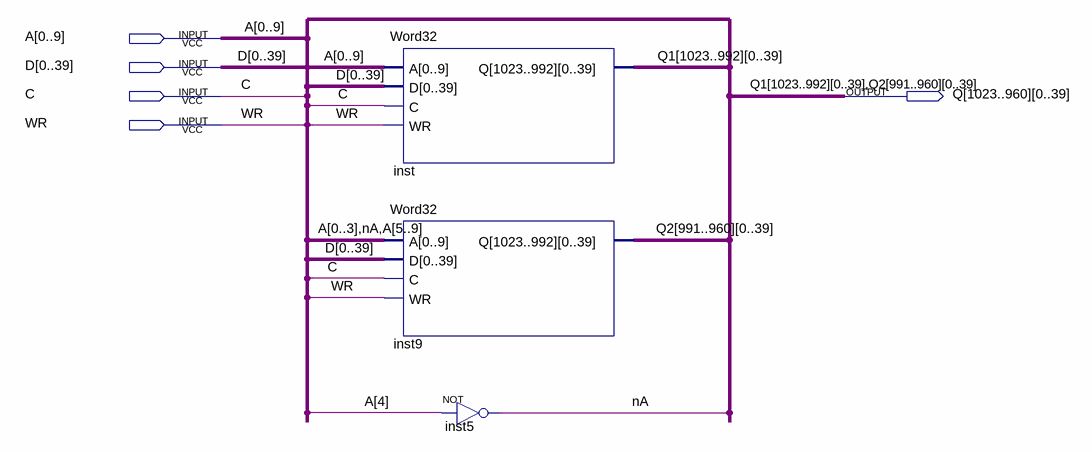
[diagram p0: schematic sheet]
// Quartus schematic Word64.bdf as structural Verilog: 3 symbols, 5 pins
module Word64 (
  input  [0:9] A,
  input  [0:39] D,
  input  C,
  input  WR,
  output [39:0] Q_1023,
  output [39:0] Q_1022,
  output [39:0] Q_1021,
  output [39:0] Q_1020,
  output [39:0] Q_1019,
  output [39:0] Q_1018,
  output [39:0] Q_1017,
  output [39:0] Q_1016,
  output [39:0] Q_1015,
  output [39:0] Q_1014,
  output [39:0] Q_1013,
  output [39:0] Q_1012,
  output [39:0] Q_1011,
  output [39:0] Q_1010,
  output [39:0] Q_1009,
  output [39:0] Q_1008,
  output [39:0] Q_1007,
  output [39:0] Q_1006,
  output [39:0] Q_1005,
  output [39:0] Q_1004,
  output [39:0] Q_1003,
  output [39:0] Q_1002,
  output [39:0] Q_1001,
  output [39:0] Q_1000,
  output [39:0] Q_999,
  output [39:0] Q_998,
  output [39:0] Q_997,
  output [39:0] Q_996,
  output [39:0] Q_995,
  output [39:0] Q_994,
  output [39:0] Q_993,
  output [39:0] Q_992,
  output [39:0] Q_991,
  output [39:0] Q_990,
  output [39:0] Q_989,
  output [39:0] Q_988,
  output [39:0] Q_987,
  output [39:0] Q_986,
  output [39:0] Q_985,
  output [39:0] Q_984,
  output [39:0] Q_983,
  output [39:0] Q_982,
  output [39:0] Q_981,
  output [39:0] Q_980,
  output [39:0] Q_979,
  output [39:0] Q_978,
  output [39:0] Q_977,
  output [39:0] Q_976,
  output [39:0] Q_975,
  output [39:0] Q_974,
  output [39:0] Q_973,
  output [39:0] Q_972,
  output [39:0] Q_971,
  output [39:0] Q_970,
  output [39:0] Q_969,
  output [39:0] Q_968,
  output [39:0] Q_967,
  output [39:0] Q_966,
  output [39:0] Q_965,
  output [39:0] Q_964,
  output [39:0] Q_963,
  output [39:0] Q_962,
  output [39:0] Q_961,
  output [39:0] Q_960
);

  wire nA;

  Word32 inst (
    .A(A), .D(D), .C(C), .WR(WR),
    .Q({Q_1023[0], Q_1023[1], Q_1023[2], Q_1023[3], Q_1023[4], Q_1023[5], Q_1023[6], Q_1023[7], Q_1023[8], Q_1023[9], Q_1023[10], Q_1023[11], Q_1023[12], Q_1023[13], Q_1023[14], Q_1023[15], Q_1023[16], Q_1023[17], Q_1023[18], Q_1023[19], Q_1023[20], Q_1023[21], Q_1023[22], Q_1023[23], Q_1023[24], Q_1023[25], Q_1023[26], Q_1023[27], Q_1023[28], Q_1023[29], Q_1023[30], Q_1023[31], Q_1023[32], Q_1023[33], Q_1023[34], Q_1023[35], Q_1023[36], Q_1023[37], Q_1023[38], Q_1023[39], Q_1022[0], Q_1022[1], Q_1022[2], Q_1022[3], Q_1022[4], Q_1022[5], Q_1022[6], Q_1022[7], Q_1022[8], Q_1022[9], Q_1022[10], Q_1022[11], Q_1022[12], Q_1022[13], Q_1022[14], Q_1022[15], Q_1022[16], Q_1022[17], Q_1022[18], Q_1022[19], Q_1022[20], Q_1022[21], Q_1022[22], Q_1022[23], Q_1022[24], Q_1022[25], Q_1022[26], Q_1022[27], Q_1022[28], Q_1022[29], Q_1022[30], Q_1022[31], Q_1022[32], Q_1022[33], Q_1022[34], Q_1022[35], Q_1022[36], Q_1022[37], Q_1022[38], Q_1022[39], Q_1021[0], Q_1021[1], Q_1021[2], Q_1021[3], Q_1021[4], Q_1021[5], Q_1021[6], Q_1021[7], Q_1021[8], Q_1021[9], Q_1021[10], Q_1021[11], Q_1021[12], Q_1021[13], Q_1021[14], Q_1021[15], Q_1021[16], Q_1021[17], Q_1021[18], Q_1021[19], Q_1021[20], Q_1021[21], Q_1021[22], Q_1021[23], Q_1021[24], Q_1021[25], Q_1021[26], Q_1021[27], Q_1021[28], Q_1021[29], Q_1021[30], Q_1021[31], Q_1021[32], Q_1021[33], Q_1021[34], Q_1021[35], Q_1021[36], Q_1021[37], Q_1021[38], Q_1021[39], Q_1020[0], Q_1020[1], Q_1020[2], Q_1020[3], Q_1020[4], Q_1020[5], Q_1020[6], Q_1020[7], Q_1020[8], Q_1020[9], Q_1020[10], Q_1020[11], Q_1020[12], Q_1020[13], Q_1020[14], Q_1020[15], Q_1020[16], Q_1020[17], Q_1020[18], Q_1020[19], Q_1020[20], Q_1020[21], Q_1020[22], Q_1020[23], Q_1020[24], Q_1020[25], Q_1020[26], Q_1020[27], Q_1020[28], Q_1020[29], Q_1020[30], Q_1020[31], Q_1020[32], Q_1020[33], Q_1020[34], Q_1020[35], Q_1020[36], Q_1020[37], Q_1020[38], Q_1020[39], Q_1019[0], Q_1019[1], Q_1019[2], Q_1019[3], Q_1019[4], Q_1019[5], Q_1019[6], Q_1019[7], Q_1019[8], Q_1019[9], Q_1019[10], Q_1019[11], Q_1019[12], Q_1019[13], Q_1019[14], Q_1019[15], Q_1019[16], Q_1019[17], Q_1019[18], Q_1019[19], Q_1019[20], Q_1019[21], Q_1019[22], Q_1019[23], Q_1019[24], Q_1019[25], Q_1019[26], Q_1019[27], Q_1019[28], Q_1019[29], Q_1019[30], Q_1019[31], Q_1019[32], Q_1019[33], Q_1019[34], Q_1019[35], Q_1019[36], Q_1019[37], Q_1019[38], Q_1019[39], Q_1018[0], Q_1018[1], Q_1018[2], Q_1018[3], Q_1018[4], Q_1018[5], Q_1018[6], Q_1018[7], Q_1018[8], Q_1018[9], Q_1018[10], Q_1018[11], Q_1018[12], Q_1018[13], Q_1018[14], Q_1018[15], Q_1018[16], Q_1018[17], Q_1018[18], Q_1018[19], Q_1018[20], Q_1018[21], Q_1018[22], Q_1018[23], Q_1018[24], Q_1018[25], Q_1018[26], Q_1018[27], Q_1018[28], Q_1018[29], Q_1018[30], Q_1018[31], Q_1018[32], Q_1018[33], Q_1018[34], Q_1018[35], Q_1018[36], Q_1018[37], Q_1018[38], Q_1018[39], Q_1017[0], Q_1017[1], Q_1017[2], Q_1017[3], Q_1017[4], Q_1017[5], Q_1017[6], Q_1017[7], Q_1017[8], Q_1017[9], Q_1017[10], Q_1017[11], Q_1017[12], Q_1017[13], Q_1017[14], Q_1017[15], Q_1017[16], Q_1017[17], Q_1017[18], Q_1017[19], Q_1017[20], Q_1017[21], Q_1017[22], Q_1017[23], Q_1017[24], Q_1017[25], Q_1017[26], Q_1017[27], Q_1017[28], Q_1017[29], Q_1017[30], Q_1017[31], Q_1017[32], Q_1017[33], Q_1017[34], Q_1017[35], Q_1017[36], Q_1017[37], Q_1017[38], Q_1017[39], Q_1016[0], Q_1016[1], Q_1016[2], Q_1016[3], Q_1016[4], Q_1016[5], Q_1016[6], Q_1016[7], Q_1016[8], Q_1016[9], Q_1016[10], Q_1016[11], Q_1016[12], Q_1016[13], Q_1016[14], Q_1016[15], Q_1016[16], Q_1016[17], Q_1016[18], Q_1016[19], Q_1016[20], Q_1016[21], Q_1016[22], Q_1016[23], Q_1016[24], Q_1016[25], Q_1016[26], Q_1016[27], Q_1016[28], Q_1016[29], Q_1016[30], Q_1016[31], Q_1016[32], Q_1016[33], Q_1016[34], Q_1016[35], Q_1016[36], Q_1016[37], Q_1016[38], Q_1016[39], Q_1015[0], Q_1015[1], Q_1015[2], Q_1015[3], Q_1015[4], Q_1015[5], Q_1015[6], Q_1015[7], Q_1015[8], Q_1015[9], Q_1015[10], Q_1015[11], Q_1015[12], Q_1015[13], Q_1015[14], Q_1015[15], Q_1015[16], Q_1015[17], Q_1015[18], Q_1015[19], Q_1015[20], Q_1015[21], Q_1015[22], Q_1015[23], Q_1015[24], Q_1015[25], Q_1015[26], Q_1015[27], Q_1015[28], Q_1015[29], Q_1015[30], Q_1015[31], Q_1015[32], Q_1015[33], Q_1015[34], Q_1015[35], Q_1015[36], Q_1015[37], Q_1015[38], Q_1015[39], Q_1014[0], Q_1014[1], Q_1014[2], Q_1014[3], Q_1014[4], Q_1014[5], Q_1014[6], Q_1014[7], Q_1014[8], Q_1014[9], Q_1014[10], Q_1014[11], Q_1014[12], Q_1014[13], Q_1014[14], Q_1014[15], Q_1014[16], Q_1014[17], Q_1014[18], Q_1014[19], Q_1014[20], Q_1014[21], Q_1014[22], Q_1014[23], Q_1014[24], Q_1014[25], Q_1014[26], Q_1014[27], Q_1014[28], Q_1014[29], Q_1014[30], Q_1014[31], Q_1014[32], Q_1014[33], Q_1014[34], Q_1014[35], Q_1014[36], Q_1014[37], Q_1014[38], Q_1014[39], Q_1013[0], Q_1013[1], Q_1013[2], Q_1013[3], Q_1013[4], Q_1013[5], Q_1013[6], Q_1013[7], Q_1013[8], Q_1013[9], Q_1013[10], Q_1013[11], Q_1013[12], Q_1013[13], Q_1013[14], Q_1013[15], Q_1013[16], Q_1013[17], Q_1013[18], Q_1013[19], Q_1013[20], Q_1013[21], Q_1013[22], Q_1013[23], Q_1013[24], Q_1013[25], Q_1013[26], Q_1013[27], Q_1013[28], Q_1013[29], Q_1013[30], Q_1013[31], Q_1013[32], Q_1013[33], Q_1013[34], Q_1013[35], Q_1013[36], Q_1013[37], Q_1013[38], Q_1013[39], Q_1012[0], Q_1012[1], Q_1012[2], Q_1012[3], Q_1012[4], Q_1012[5], Q_1012[6], Q_1012[7], Q_1012[8], Q_1012[9], Q_1012[10], Q_1012[11], Q_1012[12], Q_1012[13], Q_1012[14], Q_1012[15], Q_1012[16], Q_1012[17], Q_1012[18], Q_1012[19], Q_1012[20], Q_1012[21], Q_1012[22], Q_1012[23], Q_1012[24], Q_1012[25], Q_1012[26], Q_1012[27], Q_1012[28], Q_1012[29], Q_1012[30], Q_1012[31], Q_1012[32], Q_1012[33], Q_1012[34], Q_1012[35], Q_1012[36], Q_1012[37], Q_1012[38], Q_1012[39], Q_1011[0], Q_1011[1], Q_1011[2], Q_1011[3], Q_1011[4], Q_1011[5], Q_1011[6], Q_1011[7], Q_1011[8], Q_1011[9], Q_1011[10], Q_1011[11], Q_1011[12], Q_1011[13], Q_1011[14], Q_1011[15], Q_1011[16], Q_1011[17], Q_1011[18], Q_1011[19], Q_1011[20], Q_1011[21], Q_1011[22], Q_1011[23], Q_1011[24], Q_1011[25], Q_1011[26], Q_1011[27], Q_1011[28], Q_1011[29], Q_1011[30], Q_1011[31], Q_1011[32], Q_1011[33], Q_1011[34], Q_1011[35], Q_1011[36], Q_1011[37], Q_1011[38], Q_1011[39], Q_1010[0], Q_1010[1], Q_1010[2], Q_1010[3], Q_1010[4], Q_1010[5], Q_1010[6], Q_1010[7], Q_1010[8], Q_1010[9], Q_1010[10], Q_1010[11], Q_1010[12], Q_1010[13], Q_1010[14], Q_1010[15], Q_1010[16], Q_1010[17], Q_1010[18], Q_1010[19], Q_1010[20], Q_1010[21], Q_1010[22], Q_1010[23], Q_1010[24], Q_1010[25], Q_1010[26], Q_1010[27], Q_1010[28], Q_1010[29], Q_1010[30], Q_1010[31], Q_1010[32], Q_1010[33], Q_1010[34], Q_1010[35], Q_1010[36], Q_1010[37], Q_1010[38], Q_1010[39], Q_1009[0], Q_1009[1], Q_1009[2], Q_1009[3], Q_1009[4], Q_1009[5], Q_1009[6], Q_1009[7], Q_1009[8], Q_1009[9], Q_1009[10], Q_1009[11], Q_1009[12], Q_1009[13], Q_1009[14], Q_1009[15], Q_1009[16], Q_1009[17], Q_1009[18], Q_1009[19], Q_1009[20], Q_1009[21], Q_1009[22], Q_1009[23], Q_1009[24], Q_1009[25], Q_1009[26], Q_1009[27], Q_1009[28], Q_1009[29], Q_1009[30], Q_1009[31], Q_1009[32], Q_1009[33], Q_1009[34], Q_1009[35], Q_1009[36], Q_1009[37], Q_1009[38], Q_1009[39], Q_1008[0], Q_1008[1], Q_1008[2], Q_1008[3], Q_1008[4], Q_1008[5], Q_1008[6], Q_1008[7], Q_1008[8], Q_1008[9], Q_1008[10], Q_1008[11], Q_1008[12], Q_1008[13], Q_1008[14], Q_1008[15], Q_1008[16], Q_1008[17], Q_1008[18], Q_1008[19], Q_1008[20], Q_1008[21], Q_1008[22], Q_1008[23], Q_1008[24], Q_1008[25], Q_1008[26], Q_1008[27], Q_1008[28], Q_1008[29], Q_1008[30], Q_1008[31], Q_1008[32], Q_1008[33], Q_1008[34], Q_1008[35], Q_1008[36], Q_1008[37], Q_1008[38], Q_1008[39], Q_1007[0], Q_1007[1], Q_1007[2], Q_1007[3], Q_1007[4], Q_1007[5], Q_1007[6], Q_1007[7], Q_1007[8], Q_1007[9], Q_1007[10], Q_1007[11], Q_1007[12], Q_1007[13], Q_1007[14], Q_1007[15], Q_1007[16], Q_1007[17], Q_1007[18], Q_1007[19], Q_1007[20], Q_1007[21], Q_1007[22], Q_1007[23], Q_1007[24], Q_1007[25], Q_1007[26], Q_1007[27], Q_1007[28], Q_1007[29], Q_1007[30], Q_1007[31], Q_1007[32], Q_1007[33], Q_1007[34], Q_1007[35], Q_1007[36], Q_1007[37], Q_1007[38], Q_1007[39], Q_1006[0], Q_1006[1], Q_1006[2], Q_1006[3], Q_1006[4], Q_1006[5], Q_1006[6], Q_1006[7], Q_1006[8], Q_1006[9], Q_1006[10], Q_1006[11], Q_1006[12], Q_1006[13], Q_1006[14], Q_1006[15], Q_1006[16], Q_1006[17], Q_1006[18], Q_1006[19], Q_1006[20], Q_1006[21], Q_1006[22], Q_1006[23], Q_1006[24], Q_1006[25], Q_1006[26], Q_1006[27], Q_1006[28], Q_1006[29], Q_1006[30], Q_1006[31], Q_1006[32], Q_1006[33], Q_1006[34], Q_1006[35], Q_1006[36], Q_1006[37], Q_1006[38], Q_1006[39], Q_1005[0], Q_1005[1], Q_1005[2], Q_1005[3], Q_1005[4], Q_1005[5], Q_1005[6], Q_1005[7], Q_1005[8], Q_1005[9], Q_1005[10], Q_1005[11], Q_1005[12], Q_1005[13], Q_1005[14], Q_1005[15], Q_1005[16], Q_1005[17], Q_1005[18], Q_1005[19], Q_1005[20], Q_1005[21], Q_1005[22], Q_1005[23], Q_1005[24], Q_1005[25], Q_1005[26], Q_1005[27], Q_1005[28], Q_1005[29], Q_1005[30], Q_1005[31], Q_1005[32], Q_1005[33], Q_1005[34], Q_1005[35], Q_1005[36], Q_1005[37], Q_1005[38], Q_1005[39], Q_1004[0], Q_1004[1], Q_1004[2], Q_1004[3], Q_1004[4], Q_1004[5], Q_1004[6], Q_1004[7], Q_1004[8], Q_1004[9], Q_1004[10], Q_1004[11], Q_1004[12], Q_1004[13], Q_1004[14], Q_1004[15], Q_1004[16], Q_1004[17], Q_1004[18], Q_1004[19], Q_1004[20], Q_1004[21], Q_1004[22], Q_1004[23], Q_1004[24], Q_1004[25], Q_1004[26], Q_1004[27], Q_1004[28], Q_1004[29], Q_1004[30], Q_1004[31], Q_1004[32], Q_1004[33], Q_1004[34], Q_1004[35], Q_1004[36], Q_1004[37], Q_1004[38], Q_1004[39], Q_1003[0], Q_1003[1], Q_1003[2], Q_1003[3], Q_1003[4], Q_1003[5], Q_1003[6], Q_1003[7], Q_1003[8], Q_1003[9], Q_1003[10], Q_1003[11], Q_1003[12], Q_1003[13], Q_1003[14], Q_1003[15], Q_1003[16], Q_1003[17], Q_1003[18], Q_1003[19], Q_1003[20], Q_1003[21], Q_1003[22], Q_1003[23], Q_1003[24], Q_1003[25], Q_1003[26], Q_1003[27], Q_1003[28], Q_1003[29], Q_1003[30], Q_1003[31], Q_1003[32], Q_1003[33], Q_1003[34], Q_1003[35], Q_1003[36], Q_1003[37], Q_1003[38], Q_1003[39], Q_1002[0], Q_1002[1], Q_1002[2], Q_1002[3], Q_1002[4], Q_1002[5], Q_1002[6], Q_1002[7], Q_1002[8], Q_1002[9], Q_1002[10], Q_1002[11], Q_1002[12], Q_1002[13], Q_1002[14], Q_1002[15], Q_1002[16], Q_1002[17], Q_1002[18], Q_1002[19], Q_1002[20], Q_1002[21], Q_1002[22], Q_1002[23], Q_1002[24], Q_1002[25], Q_1002[26], Q_1002[27], Q_1002[28], Q_1002[29], Q_1002[30], Q_1002[31], Q_1002[32], Q_1002[33], Q_1002[34], Q_1002[35], Q_1002[36], Q_1002[37], Q_1002[38], Q_1002[39], Q_1001[0], Q_1001[1], Q_1001[2], Q_1001[3], Q_1001[4], Q_1001[5], Q_1001[6], Q_1001[7], Q_1001[8], Q_1001[9], Q_1001[10], Q_1001[11], Q_1001[12], Q_1001[13], Q_1001[14], Q_1001[15], Q_1001[16], Q_1001[17], Q_1001[18], Q_1001[19], Q_1001[20], Q_1001[21], Q_1001[22], Q_1001[23], Q_1001[24], Q_1001[25], Q_1001[26], Q_1001[27], Q_1001[28], Q_1001[29], Q_1001[30], Q_1001[31], Q_1001[32], Q_1001[33], Q_1001[34], Q_1001[35], Q_1001[36], Q_1001[37], Q_1001[38], Q_1001[39], Q_1000[0], Q_1000[1], Q_1000[2], Q_1000[3], Q_1000[4], Q_1000[5], Q_1000[6], Q_1000[7], Q_1000[8], Q_1000[9], Q_1000[10], Q_1000[11], Q_1000[12], Q_1000[13], Q_1000[14], Q_1000[15], Q_1000[16], Q_1000[17], Q_1000[18], Q_1000[19], Q_1000[20], Q_1000[21], Q_1000[22], Q_1000[23], Q_1000[24], Q_1000[25], Q_1000[26], Q_1000[27], Q_1000[28], Q_1000[29], Q_1000[30], Q_1000[31], Q_1000[32], Q_1000[33], Q_1000[34], Q_1000[35], Q_1000[36], Q_1000[37], Q_1000[38], Q_1000[39], Q_999[0], Q_999[1], Q_999[2], Q_999[3], Q_999[4], Q_999[5], Q_999[6], Q_999[7], Q_999[8], Q_999[9], Q_999[10], Q_999[11], Q_999[12], Q_999[13], Q_999[14], Q_999[15], Q_999[16], Q_999[17], Q_999[18], Q_999[19], Q_999[20], Q_999[21], Q_999[22], Q_999[23], Q_999[24], Q_999[25], Q_999[26], Q_999[27], Q_999[28], Q_999[29], Q_999[30], Q_999[31], Q_999[32], Q_999[33], Q_999[34], Q_999[35], Q_999[36], Q_999[37], Q_999[38], Q_999[39], Q_998[0], Q_998[1], Q_998[2], Q_998[3], Q_998[4], Q_998[5], Q_998[6], Q_998[7], Q_998[8], Q_998[9], Q_998[10], Q_998[11], Q_998[12], Q_998[13], Q_998[14], Q_998[15], Q_998[16], Q_998[17], Q_998[18], Q_998[19], Q_998[20], Q_998[21], Q_998[22], Q_998[23], Q_998[24], Q_998[25], Q_998[26], Q_998[27], Q_998[28], Q_998[29], Q_998[30], Q_998[31], Q_998[32], Q_998[33], Q_998[34], Q_998[35], Q_998[36], Q_998[37], Q_998[38], Q_998[39], Q_997[0], Q_997[1], Q_997[2], Q_997[3], Q_997[4], Q_997[5], Q_997[6], Q_997[7], Q_997[8], Q_997[9], Q_997[10], Q_997[11], Q_997[12], Q_997[13], Q_997[14], Q_997[15], Q_997[16], Q_997[17], Q_997[18], Q_997[19], Q_997[20], Q_997[21], Q_997[22], Q_997[23], Q_997[24], Q_997[25], Q_997[26], Q_997[27], Q_997[28], Q_997[29], Q_997[30], Q_997[31], Q_997[32], Q_997[33], Q_997[34], Q_997[35], Q_997[36], Q_997[37], Q_997[38], Q_997[39], Q_996[0], Q_996[1], Q_996[2], Q_996[3], Q_996[4], Q_996[5], Q_996[6], Q_996[7], Q_996[8], Q_996[9], Q_996[10], Q_996[11], Q_996[12], Q_996[13], Q_996[14], Q_996[15], Q_996[16], Q_996[17], Q_996[18], Q_996[19], Q_996[20], Q_996[21], Q_996[22], Q_996[23], Q_996[24], Q_996[25], Q_996[26], Q_996[27], Q_996[28], Q_996[29], Q_996[30], Q_996[31], Q_996[32], Q_996[33], Q_996[34], Q_996[35], Q_996[36], Q_996[37], Q_996[38], Q_996[39], Q_995[0], Q_995[1], Q_995[2], Q_995[3], Q_995[4], Q_995[5], Q_995[6], Q_995[7], Q_995[8], Q_995[9], Q_995[10], Q_995[11], Q_995[12], Q_995[13], Q_995[14], Q_995[15], Q_995[16], Q_995[17], Q_995[18], Q_995[19], Q_995[20], Q_995[21], Q_995[22], Q_995[23], Q_995[24], Q_995[25], Q_995[26], Q_995[27], Q_995[28], Q_995[29], Q_995[30], Q_995[31], Q_995[32], Q_995[33], Q_995[34], Q_995[35], Q_995[36], Q_995[37], Q_995[38], Q_995[39], Q_994[0], Q_994[1], Q_994[2], Q_994[3], Q_994[4], Q_994[5], Q_994[6], Q_994[7], Q_994[8], Q_994[9], Q_994[10], Q_994[11], Q_994[12], Q_994[13], Q_994[14], Q_994[15], Q_994[16], Q_994[17], Q_994[18], Q_994[19], Q_994[20], Q_994[21], Q_994[22], Q_994[23], Q_994[24], Q_994[25], Q_994[26], Q_994[27], Q_994[28], Q_994[29], Q_994[30], Q_994[31], Q_994[32], Q_994[33], Q_994[34], Q_994[35], Q_994[36], Q_994[37], Q_994[38], Q_994[39], Q_993[0], Q_993[1], Q_993[2], Q_993[3], Q_993[4], Q_993[5], Q_993[6], Q_993[7], Q_993[8], Q_993[9], Q_993[10], Q_993[11], Q_993[12], Q_993[13], Q_993[14], Q_993[15], Q_993[16], Q_993[17], Q_993[18], Q_993[19], Q_993[20], Q_993[21], Q_993[22], Q_993[23], Q_993[24], Q_993[25], Q_993[26], Q_993[27], Q_993[28], Q_993[29], Q_993[30], Q_993[31], Q_993[32], Q_993[33], Q_993[34], Q_993[35], Q_993[36], Q_993[37], Q_993[38], Q_993[39], Q_992[0], Q_992[1], Q_992[2], Q_992[3], Q_992[4], Q_992[5], Q_992[6], Q_992[7], Q_992[8], Q_992[9], Q_992[10], Q_992[11], Q_992[12], Q_992[13], Q_992[14], Q_992[15], Q_992[16], Q_992[17], Q_992[18], Q_992[19], Q_992[20], Q_992[21], Q_992[22], Q_992[23], Q_992[24], Q_992[25], Q_992[26], Q_992[27], Q_992[28], Q_992[29], Q_992[30], Q_992[31], Q_992[32], Q_992[33], Q_992[34], Q_992[35], Q_992[36], Q_992[37], Q_992[38], Q_992[39]}));
  Word32 inst9 (
    .A({A[0:3], nA, A[5:9]}), .D(D), .C(C), .WR(WR),
    .Q({Q_991[0], Q_991[1], Q_991[2], Q_991[3], Q_991[4], Q_991[5], Q_991[6], Q_991[7], Q_991[8], Q_991[9], Q_991[10], Q_991[11], Q_991[12], Q_991[13], Q_991[14], Q_991[15], Q_991[16], Q_991[17], Q_991[18], Q_991[19], Q_991[20], Q_991[21], Q_991[22], Q_991[23], Q_991[24], Q_991[25], Q_991[26], Q_991[27], Q_991[28], Q_991[29], Q_991[30], Q_991[31], Q_991[32], Q_991[33], Q_991[34], Q_991[35], Q_991[36], Q_991[37], Q_991[38], Q_991[39], Q_990[0], Q_990[1], Q_990[2], Q_990[3], Q_990[4], Q_990[5], Q_990[6], Q_990[7], Q_990[8], Q_990[9], Q_990[10], Q_990[11], Q_990[12], Q_990[13], Q_990[14], Q_990[15], Q_990[16], Q_990[17], Q_990[18], Q_990[19], Q_990[20], Q_990[21], Q_990[22], Q_990[23], Q_990[24], Q_990[25], Q_990[26], Q_990[27], Q_990[28], Q_990[29], Q_990[30], Q_990[31], Q_990[32], Q_990[33], Q_990[34], Q_990[35], Q_990[36], Q_990[37], Q_990[38], Q_990[39], Q_989[0], Q_989[1], Q_989[2], Q_989[3], Q_989[4], Q_989[5], Q_989[6], Q_989[7], Q_989[8], Q_989[9], Q_989[10], Q_989[11], Q_989[12], Q_989[13], Q_989[14], Q_989[15], Q_989[16], Q_989[17], Q_989[18], Q_989[19], Q_989[20], Q_989[21], Q_989[22], Q_989[23], Q_989[24], Q_989[25], Q_989[26], Q_989[27], Q_989[28], Q_989[29], Q_989[30], Q_989[31], Q_989[32], Q_989[33], Q_989[34], Q_989[35], Q_989[36], Q_989[37], Q_989[38], Q_989[39], Q_988[0], Q_988[1], Q_988[2], Q_988[3], Q_988[4], Q_988[5], Q_988[6], Q_988[7], Q_988[8], Q_988[9], Q_988[10], Q_988[11], Q_988[12], Q_988[13], Q_988[14], Q_988[15], Q_988[16], Q_988[17], Q_988[18], Q_988[19], Q_988[20], Q_988[21], Q_988[22], Q_988[23], Q_988[24], Q_988[25], Q_988[26], Q_988[27], Q_988[28], Q_988[29], Q_988[30], Q_988[31], Q_988[32], Q_988[33], Q_988[34], Q_988[35], Q_988[36], Q_988[37], Q_988[38], Q_988[39], Q_987[0], Q_987[1], Q_987[2], Q_987[3], Q_987[4], Q_987[5], Q_987[6], Q_987[7], Q_987[8], Q_987[9], Q_987[10], Q_987[11], Q_987[12], Q_987[13], Q_987[14], Q_987[15], Q_987[16], Q_987[17], Q_987[18], Q_987[19], Q_987[20], Q_987[21], Q_987[22], Q_987[23], Q_987[24], Q_987[25], Q_987[26], Q_987[27], Q_987[28], Q_987[29], Q_987[30], Q_987[31], Q_987[32], Q_987[33], Q_987[34], Q_987[35], Q_987[36], Q_987[37], Q_987[38], Q_987[39], Q_986[0], Q_986[1], Q_986[2], Q_986[3], Q_986[4], Q_986[5], Q_986[6], Q_986[7], Q_986[8], Q_986[9], Q_986[10], Q_986[11], Q_986[12], Q_986[13], Q_986[14], Q_986[15], Q_986[16], Q_986[17], Q_986[18], Q_986[19], Q_986[20], Q_986[21], Q_986[22], Q_986[23], Q_986[24], Q_986[25], Q_986[26], Q_986[27], Q_986[28], Q_986[29], Q_986[30], Q_986[31], Q_986[32], Q_986[33], Q_986[34], Q_986[35], Q_986[36], Q_986[37], Q_986[38], Q_986[39], Q_985[0], Q_985[1], Q_985[2], Q_985[3], Q_985[4], Q_985[5], Q_985[6], Q_985[7], Q_985[8], Q_985[9], Q_985[10], Q_985[11], Q_985[12], Q_985[13], Q_985[14], Q_985[15], Q_985[16], Q_985[17], Q_985[18], Q_985[19], Q_985[20], Q_985[21], Q_985[22], Q_985[23], Q_985[24], Q_985[25], Q_985[26], Q_985[27], Q_985[28], Q_985[29], Q_985[30], Q_985[31], Q_985[32], Q_985[33], Q_985[34], Q_985[35], Q_985[36], Q_985[37], Q_985[38], Q_985[39], Q_984[0], Q_984[1], Q_984[2], Q_984[3], Q_984[4], Q_984[5], Q_984[6], Q_984[7], Q_984[8], Q_984[9], Q_984[10], Q_984[11], Q_984[12], Q_984[13], Q_984[14], Q_984[15], Q_984[16], Q_984[17], Q_984[18], Q_984[19], Q_984[20], Q_984[21], Q_984[22], Q_984[23], Q_984[24], Q_984[25], Q_984[26], Q_984[27], Q_984[28], Q_984[29], Q_984[30], Q_984[31], Q_984[32], Q_984[33], Q_984[34], Q_984[35], Q_984[36], Q_984[37], Q_984[38], Q_984[39], Q_983[0], Q_983[1], Q_983[2], Q_983[3], Q_983[4], Q_983[5], Q_983[6], Q_983[7], Q_983[8], Q_983[9], Q_983[10], Q_983[11], Q_983[12], Q_983[13], Q_983[14], Q_983[15], Q_983[16], Q_983[17], Q_983[18], Q_983[19], Q_983[20], Q_983[21], Q_983[22], Q_983[23], Q_983[24], Q_983[25], Q_983[26], Q_983[27], Q_983[28], Q_983[29], Q_983[30], Q_983[31], Q_983[32], Q_983[33], Q_983[34], Q_983[35], Q_983[36], Q_983[37], Q_983[38], Q_983[39], Q_982[0], Q_982[1], Q_982[2], Q_982[3], Q_982[4], Q_982[5], Q_982[6], Q_982[7], Q_982[8], Q_982[9], Q_982[10], Q_982[11], Q_982[12], Q_982[13], Q_982[14], Q_982[15], Q_982[16], Q_982[17], Q_982[18], Q_982[19], Q_982[20], Q_982[21], Q_982[22], Q_982[23], Q_982[24], Q_982[25], Q_982[26], Q_982[27], Q_982[28], Q_982[29], Q_982[30], Q_982[31], Q_982[32], Q_982[33], Q_982[34], Q_982[35], Q_982[36], Q_982[37], Q_982[38], Q_982[39], Q_981[0], Q_981[1], Q_981[2], Q_981[3], Q_981[4], Q_981[5], Q_981[6], Q_981[7], Q_981[8], Q_981[9], Q_981[10], Q_981[11], Q_981[12], Q_981[13], Q_981[14], Q_981[15], Q_981[16], Q_981[17], Q_981[18], Q_981[19], Q_981[20], Q_981[21], Q_981[22], Q_981[23], Q_981[24], Q_981[25], Q_981[26], Q_981[27], Q_981[28], Q_981[29], Q_981[30], Q_981[31], Q_981[32], Q_981[33], Q_981[34], Q_981[35], Q_981[36], Q_981[37], Q_981[38], Q_981[39], Q_980[0], Q_980[1], Q_980[2], Q_980[3], Q_980[4], Q_980[5], Q_980[6], Q_980[7], Q_980[8], Q_980[9], Q_980[10], Q_980[11], Q_980[12], Q_980[13], Q_980[14], Q_980[15], Q_980[16], Q_980[17], Q_980[18], Q_980[19], Q_980[20], Q_980[21], Q_980[22], Q_980[23], Q_980[24], Q_980[25], Q_980[26], Q_980[27], Q_980[28], Q_980[29], Q_980[30], Q_980[31], Q_980[32], Q_980[33], Q_980[34], Q_980[35], Q_980[36], Q_980[37], Q_980[38], Q_980[39], Q_979[0], Q_979[1], Q_979[2], Q_979[3], Q_979[4], Q_979[5], Q_979[6], Q_979[7], Q_979[8], Q_979[9], Q_979[10], Q_979[11], Q_979[12], Q_979[13], Q_979[14], Q_979[15], Q_979[16], Q_979[17], Q_979[18], Q_979[19], Q_979[20], Q_979[21], Q_979[22], Q_979[23], Q_979[24], Q_979[25], Q_979[26], Q_979[27], Q_979[28], Q_979[29], Q_979[30], Q_979[31], Q_979[32], Q_979[33], Q_979[34], Q_979[35], Q_979[36], Q_979[37], Q_979[38], Q_979[39], Q_978[0], Q_978[1], Q_978[2], Q_978[3], Q_978[4], Q_978[5], Q_978[6], Q_978[7], Q_978[8], Q_978[9], Q_978[10], Q_978[11], Q_978[12], Q_978[13], Q_978[14], Q_978[15], Q_978[16], Q_978[17], Q_978[18], Q_978[19], Q_978[20], Q_978[21], Q_978[22], Q_978[23], Q_978[24], Q_978[25], Q_978[26], Q_978[27], Q_978[28], Q_978[29], Q_978[30], Q_978[31], Q_978[32], Q_978[33], Q_978[34], Q_978[35], Q_978[36], Q_978[37], Q_978[38], Q_978[39], Q_977[0], Q_977[1], Q_977[2], Q_977[3], Q_977[4], Q_977[5], Q_977[6], Q_977[7], Q_977[8], Q_977[9], Q_977[10], Q_977[11], Q_977[12], Q_977[13], Q_977[14], Q_977[15], Q_977[16], Q_977[17], Q_977[18], Q_977[19], Q_977[20], Q_977[21], Q_977[22], Q_977[23], Q_977[24], Q_977[25], Q_977[26], Q_977[27], Q_977[28], Q_977[29], Q_977[30], Q_977[31], Q_977[32], Q_977[33], Q_977[34], Q_977[35], Q_977[36], Q_977[37], Q_977[38], Q_977[39], Q_976[0], Q_976[1], Q_976[2], Q_976[3], Q_976[4], Q_976[5], Q_976[6], Q_976[7], Q_976[8], Q_976[9], Q_976[10], Q_976[11], Q_976[12], Q_976[13], Q_976[14], Q_976[15], Q_976[16], Q_976[17], Q_976[18], Q_976[19], Q_976[20], Q_976[21], Q_976[22], Q_976[23], Q_976[24], Q_976[25], Q_976[26], Q_976[27], Q_976[28], Q_976[29], Q_976[30], Q_976[31], Q_976[32], Q_976[33], Q_976[34], Q_976[35], Q_976[36], Q_976[37], Q_976[38], Q_976[39], Q_975[0], Q_975[1], Q_975[2], Q_975[3], Q_975[4], Q_975[5], Q_975[6], Q_975[7], Q_975[8], Q_975[9], Q_975[10], Q_975[11], Q_975[12], Q_975[13], Q_975[14], Q_975[15], Q_975[16], Q_975[17], Q_975[18], Q_975[19], Q_975[20], Q_975[21], Q_975[22], Q_975[23], Q_975[24], Q_975[25], Q_975[26], Q_975[27], Q_975[28], Q_975[29], Q_975[30], Q_975[31], Q_975[32], Q_975[33], Q_975[34], Q_975[35], Q_975[36], Q_975[37], Q_975[38], Q_975[39], Q_974[0], Q_974[1], Q_974[2], Q_974[3], Q_974[4], Q_974[5], Q_974[6], Q_974[7], Q_974[8], Q_974[9], Q_974[10], Q_974[11], Q_974[12], Q_974[13], Q_974[14], Q_974[15], Q_974[16], Q_974[17], Q_974[18], Q_974[19], Q_974[20], Q_974[21], Q_974[22], Q_974[23], Q_974[24], Q_974[25], Q_974[26], Q_974[27], Q_974[28], Q_974[29], Q_974[30], Q_974[31], Q_974[32], Q_974[33], Q_974[34], Q_974[35], Q_974[36], Q_974[37], Q_974[38], Q_974[39], Q_973[0], Q_973[1], Q_973[2], Q_973[3], Q_973[4], Q_973[5], Q_973[6], Q_973[7], Q_973[8], Q_973[9], Q_973[10], Q_973[11], Q_973[12], Q_973[13], Q_973[14], Q_973[15], Q_973[16], Q_973[17], Q_973[18], Q_973[19], Q_973[20], Q_973[21], Q_973[22], Q_973[23], Q_973[24], Q_973[25], Q_973[26], Q_973[27], Q_973[28], Q_973[29], Q_973[30], Q_973[31], Q_973[32], Q_973[33], Q_973[34], Q_973[35], Q_973[36], Q_973[37], Q_973[38], Q_973[39], Q_972[0], Q_972[1], Q_972[2], Q_972[3], Q_972[4], Q_972[5], Q_972[6], Q_972[7], Q_972[8], Q_972[9], Q_972[10], Q_972[11], Q_972[12], Q_972[13], Q_972[14], Q_972[15], Q_972[16], Q_972[17], Q_972[18], Q_972[19], Q_972[20], Q_972[21], Q_972[22], Q_972[23], Q_972[24], Q_972[25], Q_972[26], Q_972[27], Q_972[28], Q_972[29], Q_972[30], Q_972[31], Q_972[32], Q_972[33], Q_972[34], Q_972[35], Q_972[36], Q_972[37], Q_972[38], Q_972[39], Q_971[0], Q_971[1], Q_971[2], Q_971[3], Q_971[4], Q_971[5], Q_971[6], Q_971[7], Q_971[8], Q_971[9], Q_971[10], Q_971[11], Q_971[12], Q_971[13], Q_971[14], Q_971[15], Q_971[16], Q_971[17], Q_971[18], Q_971[19], Q_971[20], Q_971[21], Q_971[22], Q_971[23], Q_971[24], Q_971[25], Q_971[26], Q_971[27], Q_971[28], Q_971[29], Q_971[30], Q_971[31], Q_971[32], Q_971[33], Q_971[34], Q_971[35], Q_971[36], Q_971[37], Q_971[38], Q_971[39], Q_970[0], Q_970[1], Q_970[2], Q_970[3], Q_970[4], Q_970[5], Q_970[6], Q_970[7], Q_970[8], Q_970[9], Q_970[10], Q_970[11], Q_970[12], Q_970[13], Q_970[14], Q_970[15], Q_970[16], Q_970[17], Q_970[18], Q_970[19], Q_970[20], Q_970[21], Q_970[22], Q_970[23], Q_970[24], Q_970[25], Q_970[26], Q_970[27], Q_970[28], Q_970[29], Q_970[30], Q_970[31], Q_970[32], Q_970[33], Q_970[34], Q_970[35], Q_970[36], Q_970[37], Q_970[38], Q_970[39], Q_969[0], Q_969[1], Q_969[2], Q_969[3], Q_969[4], Q_969[5], Q_969[6], Q_969[7], Q_969[8], Q_969[9], Q_969[10], Q_969[11], Q_969[12], Q_969[13], Q_969[14], Q_969[15], Q_969[16], Q_969[17], Q_969[18], Q_969[19], Q_969[20], Q_969[21], Q_969[22], Q_969[23], Q_969[24], Q_969[25], Q_969[26], Q_969[27], Q_969[28], Q_969[29], Q_969[30], Q_969[31], Q_969[32], Q_969[33], Q_969[34], Q_969[35], Q_969[36], Q_969[37], Q_969[38], Q_969[39], Q_968[0], Q_968[1], Q_968[2], Q_968[3], Q_968[4], Q_968[5], Q_968[6], Q_968[7], Q_968[8], Q_968[9], Q_968[10], Q_968[11], Q_968[12], Q_968[13], Q_968[14], Q_968[15], Q_968[16], Q_968[17], Q_968[18], Q_968[19], Q_968[20], Q_968[21], Q_968[22], Q_968[23], Q_968[24], Q_968[25], Q_968[26], Q_968[27], Q_968[28], Q_968[29], Q_968[30], Q_968[31], Q_968[32], Q_968[33], Q_968[34], Q_968[35], Q_968[36], Q_968[37], Q_968[38], Q_968[39], Q_967[0], Q_967[1], Q_967[2], Q_967[3], Q_967[4], Q_967[5], Q_967[6], Q_967[7], Q_967[8], Q_967[9], Q_967[10], Q_967[11], Q_967[12], Q_967[13], Q_967[14], Q_967[15], Q_967[16], Q_967[17], Q_967[18], Q_967[19], Q_967[20], Q_967[21], Q_967[22], Q_967[23], Q_967[24], Q_967[25], Q_967[26], Q_967[27], Q_967[28], Q_967[29], Q_967[30], Q_967[31], Q_967[32], Q_967[33], Q_967[34], Q_967[35], Q_967[36], Q_967[37], Q_967[38], Q_967[39], Q_966[0], Q_966[1], Q_966[2], Q_966[3], Q_966[4], Q_966[5], Q_966[6], Q_966[7], Q_966[8], Q_966[9], Q_966[10], Q_966[11], Q_966[12], Q_966[13], Q_966[14], Q_966[15], Q_966[16], Q_966[17], Q_966[18], Q_966[19], Q_966[20], Q_966[21], Q_966[22], Q_966[23], Q_966[24], Q_966[25], Q_966[26], Q_966[27], Q_966[28], Q_966[29], Q_966[30], Q_966[31], Q_966[32], Q_966[33], Q_966[34], Q_966[35], Q_966[36], Q_966[37], Q_966[38], Q_966[39], Q_965[0], Q_965[1], Q_965[2], Q_965[3], Q_965[4], Q_965[5], Q_965[6], Q_965[7], Q_965[8], Q_965[9], Q_965[10], Q_965[11], Q_965[12], Q_965[13], Q_965[14], Q_965[15], Q_965[16], Q_965[17], Q_965[18], Q_965[19], Q_965[20], Q_965[21], Q_965[22], Q_965[23], Q_965[24], Q_965[25], Q_965[26], Q_965[27], Q_965[28], Q_965[29], Q_965[30], Q_965[31], Q_965[32], Q_965[33], Q_965[34], Q_965[35], Q_965[36], Q_965[37], Q_965[38], Q_965[39], Q_964[0], Q_964[1], Q_964[2], Q_964[3], Q_964[4], Q_964[5], Q_964[6], Q_964[7], Q_964[8], Q_964[9], Q_964[10], Q_964[11], Q_964[12], Q_964[13], Q_964[14], Q_964[15], Q_964[16], Q_964[17], Q_964[18], Q_964[19], Q_964[20], Q_964[21], Q_964[22], Q_964[23], Q_964[24], Q_964[25], Q_964[26], Q_964[27], Q_964[28], Q_964[29], Q_964[30], Q_964[31], Q_964[32], Q_964[33], Q_964[34], Q_964[35], Q_964[36], Q_964[37], Q_964[38], Q_964[39], Q_963[0], Q_963[1], Q_963[2], Q_963[3], Q_963[4], Q_963[5], Q_963[6], Q_963[7], Q_963[8], Q_963[9], Q_963[10], Q_963[11], Q_963[12], Q_963[13], Q_963[14], Q_963[15], Q_963[16], Q_963[17], Q_963[18], Q_963[19], Q_963[20], Q_963[21], Q_963[22], Q_963[23], Q_963[24], Q_963[25], Q_963[26], Q_963[27], Q_963[28], Q_963[29], Q_963[30], Q_963[31], Q_963[32], Q_963[33], Q_963[34], Q_963[35], Q_963[36], Q_963[37], Q_963[38], Q_963[39], Q_962[0], Q_962[1], Q_962[2], Q_962[3], Q_962[4], Q_962[5], Q_962[6], Q_962[7], Q_962[8], Q_962[9], Q_962[10], Q_962[11], Q_962[12], Q_962[13], Q_962[14], Q_962[15], Q_962[16], Q_962[17], Q_962[18], Q_962[19], Q_962[20], Q_962[21], Q_962[22], Q_962[23], Q_962[24], Q_962[25], Q_962[26], Q_962[27], Q_962[28], Q_962[29], Q_962[30], Q_962[31], Q_962[32], Q_962[33], Q_962[34], Q_962[35], Q_962[36], Q_962[37], Q_962[38], Q_962[39], Q_961[0], Q_961[1], Q_961[2], Q_961[3], Q_961[4], Q_961[5], Q_961[6], Q_961[7], Q_961[8], Q_961[9], Q_961[10], Q_961[11], Q_961[12], Q_961[13], Q_961[14], Q_961[15], Q_961[16], Q_961[17], Q_961[18], Q_961[19], Q_961[20], Q_961[21], Q_961[22], Q_961[23], Q_961[24], Q_961[25], Q_961[26], Q_961[27], Q_961[28], Q_961[29], Q_961[30], Q_961[31], Q_961[32], Q_961[33], Q_961[34], Q_961[35], Q_961[36], Q_961[37], Q_961[38], Q_961[39], Q_960[0], Q_960[1], Q_960[2], Q_960[3], Q_960[4], Q_960[5], Q_960[6], Q_960[7], Q_960[8], Q_960[9], Q_960[10], Q_960[11], Q_960[12], Q_960[13], Q_960[14], Q_960[15], Q_960[16], Q_960[17], Q_960[18], Q_960[19], Q_960[20], Q_960[21], Q_960[22], Q_960[23], Q_960[24], Q_960[25], Q_960[26], Q_960[27], Q_960[28], Q_960[29], Q_960[30], Q_960[31], Q_960[32], Q_960[33], Q_960[34], Q_960[35], Q_960[36], Q_960[37], Q_960[38], Q_960[39]}));
  not inst5 (nA, A[4]);

  // Other names for the same wires on the sheet: Q1_992[39:0] = Q_992; Q1_993[39:0] = Q_993; Q1_994[39:0] = Q_994;
  //   Q1_995[39:0] = Q_995; Q1_996[39:0] = Q_996; Q1_997[39:0] = Q_997; Q1_998[39:0] = Q_998; Q1_999[39:0] = Q_999;
  //   Q1_1000[39:0] = Q_1000; Q1_1001[39:0] = Q_1001; Q1_1002[39:0] = Q_1002; Q1_1003[39:0] = Q_1003;
  //   Q1_1004[39:0] = Q_1004; Q1_1005[39:0] = Q_1005; Q1_1006[39:0] = Q_1006; Q1_1007[39:0] = Q_1007;
  //   Q1_1008[39:0] = Q_1008; Q1_1009[39:0] = Q_1009; Q1_1010[39:0] = Q_1010; Q1_1011[39:0] = Q_1011;
  //   Q1_1012[39:0] = Q_1012; Q1_1013[39:0] = Q_1013; Q1_1014[39:0] = Q_1014; Q1_1015[39:0] = Q_1015;
  //   Q1_1016[39:0] = Q_1016; Q1_1017[39:0] = Q_1017; Q1_1018[39:0] = Q_1018; Q1_1019[39:0] = Q_1019;
  //   Q1_1020[39:0] = Q_1020; Q1_1021[39:0] = Q_1021; Q1_1022[39:0] = Q_1022; Q1_1023[39:0] = Q_1023;
  //   Q2_960[39:0] = Q_960; Q2_961[39:0] = Q_961; Q2_962[39:0] = Q_962; Q2_963[39:0] = Q_963; Q2_964[39:0] = Q_964;
  //   Q2_965[39:0] = Q_965; Q2_966[39:0] = Q_966; Q2_967[39:0] = Q_967; Q2_968[39:0] = Q_968; Q2_969[39:0] = Q_969;
  //   Q2_970[39:0] = Q_970; Q2_971[39:0] = Q_971; Q2_972[39:0] = Q_972; Q2_973[39:0] = Q_973; Q2_974[39:0] = Q_974;
  //   Q2_975[39:0] = Q_975; Q2_976[39:0] = Q_976; Q2_977[39:0] = Q_977; Q2_978[39:0] = Q_978; Q2_979[39:0] = Q_979;
  //   Q2_980[39:0] = Q_980; Q2_981[39:0] = Q_981; Q2_982[39:0] = Q_982; Q2_983[39:0] = Q_983; Q2_984[39:0] = Q_984;
  //   Q2_985[39:0] = Q_985; Q2_986[39:0] = Q_986; Q2_987[39:0] = Q_987; Q2_988[39:0] = Q_988; Q2_989[39:0] = Q_989;
  //   Q2_990[39:0] = Q_990; Q2_991[39:0] = Q_991
endmodule
